# Altium schematic sheet DE-260924.SchDoc: Toroid soft start
size A3; Author: eldar6776@hotmail.com; DrawnBy: Eldar Dedic; Organization: JUBERA d.o.o.; Address1: Braće Mulić 81; Address2: 71000 Sarajevo; Address3: Federacija BiH; Address4: Bosna i Hercegovina; DocumentNumber: DE-100224; Revision: 278; SheetNumber: 1; SheetTotal: 2; SPICEModelCacheBVBUIEPD: <root> / <DocumentId>BVBUIEPD</DocumentId> / <CacheFrame Number="0"> / <Model Name="dpsw3" Kind="CKT"> / <Text>* DIP switch 3 / * jjt 20/6/2002: created / * / *             Switch connections: / *             sw1 / *             |  |  sw2 / *             |  |  |  |  sw3 / *             |  |  |  |  |  | / *             |  |  |  |  |  | / .subckt dpsw3 1  2  4  5  7  8 / + PARAMS: STATE1=0 STATE2=0 STATE3=0 RON=1m ROFF=100E6 / * / V1 3 0 {STATE1} / V2 6 0 {STATE2} / V3 9 0 {STATE3} / * / SDIP1 1 2 3 0 DIPMOD / SDIP2 4 5 6 0 DIPMOD / SDIP3 7 8 9 0 DIPMOD / * / .MODEL DIPMOD SW(VT=0.5 RON={RON} ROFF={ROFF}) / .ends dpsw3</Text> / </Model> / <Model Name="bzt52c3v3" Kind="CKT"> / <Text>*BZT52C3V3 MCE 4/8/98 / *Ref: Diodes Incorporated, 1994 / *3.3V 410mW Si Zener pkg:60A2 1,2 / .SUBCKT BZT52C3V3 1 2 / *    TERMINALS:  A K / D1 1 2  DF / DZ 3 1  DR / VZ 2 3  2.591 / .MODEL DF D (IS=2.06N RS=0.102 N=1.7 CJO=149P VJ=0.75 M=0.33 TT=50.1N) / .MODEL DR D (IS=1.11M RS=28.5 N=13) / .ENDS</Text> / </Model> / <Model Name="bzt52c12" Kind="CKT"> / <Text>*BZT52C12 MCE 4/8/98 / *Ref: Diodes Incorporated, 1994 / *12V 410mW Si Zener pkg:60A2 1,2 / .SUBCKT BZT52C12 1 2 / *    TERMINALS:  A K / D1 1 2  DF / DZ 3 1  DR / VZ 2 3  11.46 / .MODEL DF D (IS=2.06N RS=0.102 N=1.7 CJO=47.5P VJ=1 M=0.33 TT=50.1N) / .MODEL DR D (IS=16.5U RS=7.5 N=3.4) / .ENDS</Text> / </Model> / </CacheFrame> / </root>
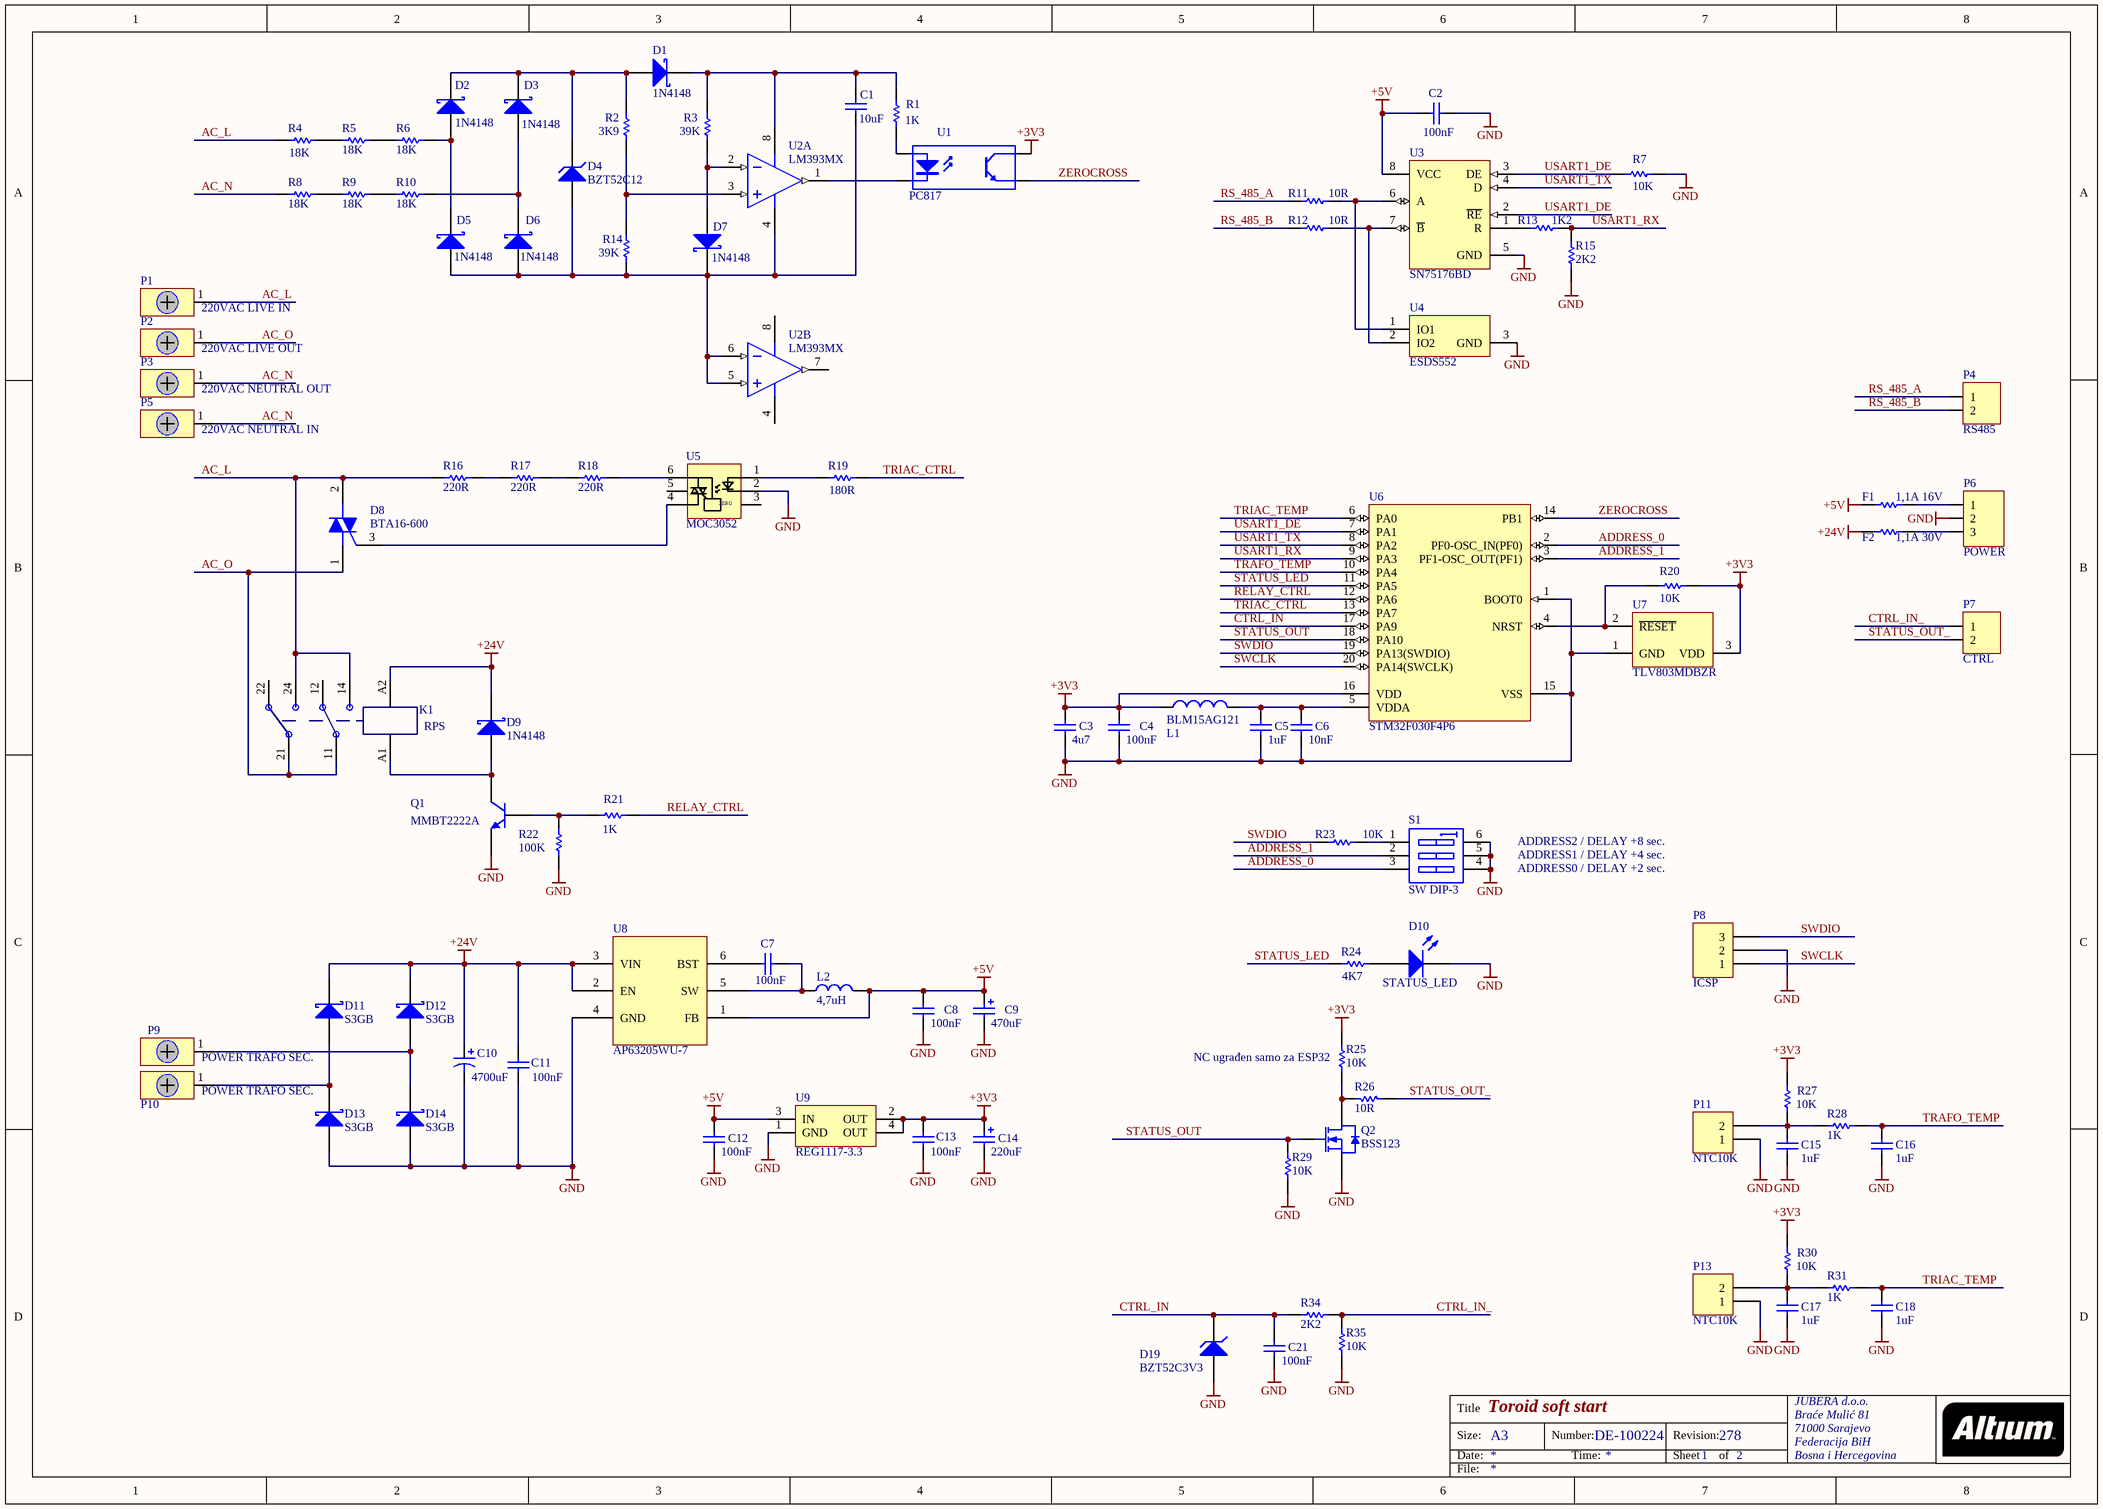
[diagram p0: DE-260924.SchDoc]

## Parts
C1  value 10uF  [0805]
C2  value 100nF  [0603]
C3  value 4u7  [0805]  (hidden comment: C0805)
C4  value 100nF  [0603]  (hidden comment: C0603)
C5  value 1uF  [0603]  (hidden comment: C0603)
C6  value 10nF  [0603]  (hidden comment: C0603)
C7  value 100nF  [0603]
C8  value 100nF  [0603]  (hidden comment: C0603)
C9  470uF  [SMD,D6.3xL7.7mm Aluminum Electrolytic Capacitors]
C10  4700uF  [CAPPR5-13X25]
C11  value 100nF  [0603]
C12  value 100nF  [0603]
C13  value 100nF  [0603]
C14  220uF  [SMD,D6.3xL7.7mm Aluminum Electrolytic Capacitors]
C15  1uF  [0603]
C16  value 1uF  [0603]
C17  value 1uF  [0603]
C18  value 1uF  [0603]
C21  value 100nF  [0603]
D1  1N4148  [SOD323]
D2  1N4148  [SOD323]
D3  1N4148  [SOD323]
D4  BZT52C12  [SOD-123]
D5  1N4148  [SOD323]
D6  1N4148  [SOD323]
D7  1N4148  [SOD323]
D8  BTA16-600  [ONSC-TO-220-3-221A-07]
D9  1N4148  [SOD323]
D10  STATUS_LED  [1.6X0.8X0.8]
D11  S3GB  [SMB]
D12  S3GB  [SMB]
D13  S3GB  [SMB]
D14  S3GB  [SMB]
D19  BZT52C3V3  [SOD-123]
F1  1,1A 16V  [12-1812]
F2  1,1A 30V  [12-1812]
K1  RPS  [RPS 2CO 8A 24V]
L1  BLM15AG121  [0603]
L2  4,7uH  [XRNR4030-4.7uH/M]
P1  220VAC LIVE IN  [WIRE PAD]
P2  220VAC LIVE OUT  [WIRE PAD]
P3  220VAC NEUTRAL OUT  [WIRE PAD]
P4  RS485  [TERMINAL BLOK 2]
P5  220VAC NEUTRAL IN  [WIRE PAD]
P6  POWER  [TERMINAL BLOK 3]
P7  CTRL  [TERMINAL BLOK 2]
P8  ICSP  [HDR1X3]
P9  POWER TRAFO SEC.  [WIRE PAD]
P10  POWER TRAFO SEC.  [WIRE PAD]
P11  NTC10K  [HDR1X2]
P13  NTC10K  [HDR1X2]
Q1  MMBT2222A  [SOT23_N]
Q2  BSS123  [SOT23_N]
R1  1K  [ERA-0603]
R2  3K9  [ERA-0603]
R3  39K  [ERA-0603]
R4  value 18K  [ERA-0805]  (hidden comment: 0805)
R5  18K  [ERA-0805]
R6  18K  [ERA-0805]
R7  10K  [ERA-0603]
R8  18K  [ERA-0805]
R9  18K  [ERA-0805]
R10  18K  [ERA-0805]
R11  10R  [ERA-0805]
R12  10R  [ERA-0805]
R13  1K2  [ERA-0603]
R14  39K  [ERA-0603]
R15  2K2  [ERA-0603]
R16  220R  [ERA-0805]
R17  220R  [ERA-0805]
R18  220R  [ERA-0805]
R19  180R  [ERA-0603]
R20  value 10K  [ERA-0603]  (hidden comment: 180R)
R21  1K  [ERA-0603]
R22  100K  [ERA-0603]
R23  value 10K  [ERA-0603]  (hidden comment: 180R)
R24  value 4K7  [ERA-0603]  (hidden comment: 180R)
R25  value 10K  [ERA-0603]  (hidden comment: 180R)
R26  10R  [ERA-0603]
R27  10K  [ERA-0603]
R28  1K  [ERA-0603]
R29  value 10K  [ERA-0603]  (hidden comment: 180R)
R30  10K  [ERA-0603]
R31  1K  [ERA-0603]
R34  value 2K2  [ERA-0603]  (hidden comment: 180R)
R35  value 10K  [ERA-0603]  (hidden comment: 180R)
S1  SW DIP-3  [DIP-6]
U1  PC817  [DIP-4]
U2  LM393MX  [M08A_N]  (parts A,B of 2)
U3  SN75176BD  [D008_N]
U4  ESDS552  [DCK3_N]
U5  MOC3052  [DIP6]
U6  STM32F030F4P6  [STM-TSSOP20_N]
U7  TLV803MDBZR  [DBZ3_N]
U8  AP63205WU-7  [TSOT-26]
U9  REG1117-3.3  [ZZ311]

## Nets
+3V3: C3.2 C4.2 C13.2 C14.1 L1.1 R20.1 R25.1 R27.2 R30.2 U1.4(C) U6.16(VDD) U7.3(VDD) U9.2(OUT) U9.4(OUT)
+5V: C2.2 C8.2 C9.1 C12.2 F1.1 L2.1 U3.8(VCC) U8.1(FB) U9.3(IN)
+24V: C10.1 C11.2 D9.1(K) D11.2(K) D12.2(K) F2.1 K1.A2 U8.2(EN) U8.3(VIN)
GND: C2.1 C3.1 C4.1 C5.1 C6.1 C8.1 C9.2 C10.2 C11.1 C12.1 C13.1 C14.2 C15.2 C16.2 C17.2 C18.2 C21.1 D10.2(K) D13.1(A) D14.1(A) D19.1(A) P6.2 P8.2 P11.1 P13.1 Q1.2(E) Q2.2(S) R7.2 R15.1 R22.1 R29.2 R35.2 S1.4(B3) S1.5(B2) S1.6(B1) U3.5(GND) U4.3(GND) U5.2 U6.1(BOOT0) U6.15(VSS) U7.1(GND) U8.4(GND) U9.1(GND)
AC_L: D8.2(MT2) K1.14 K1.24 P1.1 R4.1 R16.1
AC_N: P3.1 P5.1 R8.1
AC_O: D8.1(MT1) K1.11 K1.21 P2.1
ADDRESS_0: S1.3(A3) U6.2(PF0-OSC_IN(PF0))
ADDRESS_1: S1.2(A2) U6.3(PF1-OSC_OUT(PF1))
CTRL_IN: C21.2 D19.2(K) R34.1 U6.17(PA9)
CTRL_IN_: P7.1 R34.2 R35.1
RELAY_CTRL: R21.1 U6.12(PA6)
RS_485_A: P4.1 R11.1
RS_485_B: P4.2 R12.1
STATUS_LED: R24.2 U6.11(PA5)
STATUS_OUT: Q2.1(G) R29.1 U6.18(PA10)
STATUS_OUT_: P7.2 R26.2
SWCLK: P8.1 U6.20(PA14(SWCLK))
SWDIO: P8.3 R23.2 U6.19(PA13(SWDIO))
TRAFO_TEMP: C16.1 R28.1 U6.10(PA4)
TRIAC_CTRL: R19.1 U6.13(PA7)
TRIAC_TEMP: C18.1 R31.1 U6.6(PA0)
USART1_DE: R7.1 U3.2(~{RE}) U3.3(DE) U6.7(PA1)
USART1_RX: R13.2 R15.2 U6.9(PA3)
USART1_TX: U3.4(D) U6.8(PA2)
ZEROCROSS: U1.3(E) U6.14(PB1)
NetC1_1: C1.1 D4.1(A) D5.2(A) D6.2(A) D7.1(K) R14.1 U2.4(GND) U2.5(INB+) U2.6(INB-)
NetC1_2: C1.2 D1.1(K) R1.2 R3.2 U2.8(V+)
NetC5_2: C5.2 C6.2 L1.2 U6.5(VDDA)
NetC7_1: C7.1 L2.2 U8.5(SW)
NetC7_2: C7.2 U8.6(BST)
NetC15_1: C15.1 P11.2 R27.1 R28.2
NetC17_1: C17.1 P13.2 R30.1 R31.2
NetD1_2: D1.2(A) D2.1(K) D3.1(K) D4.2(K) R2.2
NetD2_2: D2.2(A) D5.1(K) R6.2
NetD3_2: D3.2(A) D6.1(K) R10.2
NetD7_2: D7.2(A) R3.1 U2.2(INA-)
NetD8_3: D8.3(G) U5.4
NetD9_2: D9.2(A) K1.A1 Q1.3(C)
NetD10_1: D10.1(A) R24.1
NetD11_1: D11.1(A) D13.2(K) P10.1
NetD12_1: D12.1(A) D14.2(K) P9.1
NetF1_2: F1.2 P6.1
NetF2_2: F2.2 P6.3
NetQ1_1: Q1.1(B) R21.2 R22.2
NetQ2_3: Q2.3(D) R25.2 R26.1
NetR1_1: R1.1 U1.1(A)
NetR2_1: R2.1 R14.2 U2.3(INA+)
NetR4_2: R4.2 R5.1
NetR5_2: R5.2 R6.1
NetR8_2: R8.2 R9.1
NetR9_2: R9.2 R10.1
NetR11_2: R11.2 U3.6(A) U4.1(IO1)
NetR12_2: R12.2 U3.7(~{B}) U4.2(IO2)
NetR13_1: R13.1 U3.1(R)
NetR16_2: R16.2 R17.1
NetR17_2: R17.2 R18.1
NetR18_2: R18.2 U5.6
NetR19_2: R19.2 U5.1
NetR20_2: R20.2 U6.4(NRST) U7.2(~{RESET})
NetR23_1: R23.1 S1.1(A1)
NetU1_2: U1.2(K) U2.1(OUTA)

Not connected (* = marked no-connect by the designer): K1 12(5) 22(5); U2 7(OUTB); U5 3 5

## Notes on the sheet
- ADDRESS1 / DELAY +4 sec.
- ADDRESS2 / DELAY +8 sec.
- ADDRESS0 / DELAY +2 sec.
- (near R25) NC ugrađen samo za ESP32
- Title
- Size:
- Date:
- A3
- Number:
- Time:
- Revision:
- Sheet
- of
- File:
- (in symbol MOC3081) ZERO

## Library data of the parts
C1 C3 = C0805: Ceramic Chip Capacitor - Standard; Note: Footprint corresponds to dimensions for bulk cassette packaging. This case size has tightened tolerances.; Published: 17-Jul-2002; LatestRevisionDate: 19-Mar-2004; LatestRevisionNote: Silkscreen size reduced.; DatasheetDocument: Mar-2001; PackageDocument: Mar-2001; PackageReference: 0805; Publisher: Altium Limited; Code_JEITA: 0805; Code_IPC: 2012[0805]; ComponentLink1Description: Manufacturer Link; ComponentLink1URL: http://www.kemet.com/; ComponentLink2Description: Datasheet; ComponentLink2URL: http://www.kemet.com/kemet/web/homepage/kechome.nsf/vapubfilesname/F3102TA.pdf/$file/F3102TA.pdf
C2 C4-C6 C11 C13 C15-C18 C21 = C0603: Ceramic Chip Capacitor - Standard; Note: Footprint corresponds to dimensions for bulk cassette packaging. This case size has tightened tolerances.; Published: 17-Jul-2002; LatestRevisionDate: 19-Mar-2004; LatestRevisionNote: Silkscreen size reduced.; DatasheetDocument: Mar-2001; PackageDocument: Mar-2001; PackageReference: 0603; Publisher: Altium Limited; Code_JEITA: 0603; Code_IPC: 1608 [0603]; ComponentLink1Description: Manufacturer Link; ComponentLink1URL: http://www.kemet.com/; ComponentLink2Description: Datasheet; ComponentLink2URL: http://www.kemet.com/kemet/web/homepage/kechome.nsf/vapubfilesname/F3102TA.pdf/$file/F3102TA.pdf
  C15: Value: 1uF
C7 C8 C12 = C0603: Ceramic Chip Capacitor - 25V; Note: Footprint corresponds to dimensions for bulk cassette packaging. This case size has tightened tolerances.; Published: 17-Jul-2002; LatestRevisionDate: 19-Mar-2004; LatestRevisionNote: Silkscreen size reduced.; DatasheetDocument: Mar-2001; PackageDocument: Mar-2001; PackageReference: 0603; Publisher: Altium Limited; Code_JEITA: 0603; Code_IPC: 1608 [0603]; ComponentLink1Description: Manufacturer Link; ComponentLink1URL: http://www.kemet.com/; ComponentLink2Description: Datasheet; ComponentLink2URL: http://www.kemet.com/kemet/web/homepage/kechome.nsf/vapubfilesname/F3102TA.pdf/$file/F3102TA.pdf
C9 = ROQANG RVT1C471M0607: 470uF 16V 185mA@120Hz ±20% SMD,D6.3xL7.7mm Aluminum Electrolytic Capacitors - SMD ROHS; Note: Refer to Manufacturer's Data Sheets for other lead formations; DrillSize: Nominal, Rounded To The Nearest 0.1mm; Value: 10uF; Published: 19-Mar-2004; DatasheetDocument: 20-Feb-2001; PackageReference: CAPPR2-5X11; Publisher: Altium Limited; ComponentLink1Description: Manufacturer Link; ComponentLink1URL: http://www.vishay.com/; ComponentLink2Description: Datasheet; ComponentLink2URL: http://www.vishay.com/docs/25014/eka.pdf
C10 = EKA00GG447C00: Aluminum Electrolytic Capacitor, Radial Style with Long Leads: 4700uF, 10V; Note: Refer to Manufacturer's Data Sheets for other lead formations; DrillSize: Nominal, Rounded To The Nearest 0.1mm; Published: 19-Mar-2004; DatasheetDocument: 20-Feb-2001; PackageReference: CAPPR5-13X25; Publisher: Altium Limited; ComponentLink1Description: Manufacturer Link; ComponentLink1URL: http://www.vishay.com/; ComponentLink2Description: Datasheet; ComponentLink2URL: http://www.vishay.com/docs/25014/eka.pdf; Value: 4700uF
C14 = ROQANG VT1C221M0607: 220uF 16V 110mA@120Hz ±20% SMD,D6.3xL7.7mm Aluminum Electrolytic Capacitors - SMD ROHS; Note: Refer to Manufacturer's Data Sheets for other lead formations; DrillSize: Nominal, Rounded To The Nearest 0.1mm; Value: 10uF; Published: 19-Mar-2004; DatasheetDocument: 20-Feb-2001; PackageReference: CAPPR2-5X11; Publisher: Altium Limited; ComponentLink1Description: Manufacturer Link; ComponentLink1URL: http://www.vishay.com/; ComponentLink2Description: Datasheet; ComponentLink2URL: http://www.vishay.com/docs/25014/eka.pdf
D1-D3 D5-D7 D9 = 1PS76SB10: Schottky Barrier Diode; Published: 17-Sep-2003; LatestRevisionDate: 19-Mar-2004; LatestRevisionNote: Silkscreen size reduced.; DatasheetVersion: 14-Oct-1996; PackageVersion: May-1999; PackageReference: SOD323; Publisher: Altium Limited; PackageDescription: SOD-323/SC-76; 2 Leads; Body 1.7 x 1.3 mm, (LxW); ComponentLink1Description: Manufacturer Link; ComponentLink1URL: http://www.semiconductors.philips.com/; ComponentLink2Description: Datasheet; ComponentLink2URL: http://www.semiconductors.philips.com/acrobat/datasheets/1PS76SB10_2.pdf
D4 = BZT52C12: Surface Mount Zener Diode; Published: 8-Jun-2000; LatestRevisionDate: 17-Jul-2002; LatestRevisionNote: Re-released for DXP Platform.; DatasheetDocument: REV. L-2; PackageReference: SOD-123; Publisher: Altium Limited; ComponentLink1Description: Manufacturer Link; ComponentLink1URL: http://www.vishay.com/
D8 = BTA08-600BW3G: Triacs, Silicon Bidirectional Thyristor, 3-Pin TO-220, Pb-Free, Tube; Manufacturer: On Semiconductor; IGT Max (mA): 50; IT(RMS) Max (A): 8; ITSM Max (A): 90; DatasheetVersion: Rev. 1; PackageVersion: Rev. O, 07/2008; PackageReference: TO-220-3-221A-07; PackageDescription: 3-Pin Flange Mount, Vertical Straight Lead, Body 9.97 x 4.445 mm, Pitch 2.54 mm; Supplier 1: Digi-Key; Supplier Part Number 1: BTA08-600BW3G-ND; Supplier 2: Newark; Supplier Part Number 2: 13P2072; Supplier 3: Mouser; Supplier Part Number 3: 863-BTA08-600BW3G; Packing: Tube; RoHS: Pb-Free; Mounting Technology: Through Hole; PartNumber: BTA08-600BW3G; ComponentLink1Description: Manufacturer URL; ComponentLink1URL: http://www.onsemi.com/; ComponentLink2Description: Datasheet; ComponentLink2URL: http://www.onsemi.com/pub_link/Collateral/BTA08-600BW3-D.PDF; ComponentLink3Description: Package Specification; ComponentLink3URL: http://www.onsemi.com/pub_link/Collateral/221A-07.PDF
D10 = HSMB-C190: Blue Surface Mount Chip LED, Blue; LuminousIntensity: 1.6mcd (Minimum).; PCB_Layout: Complies with manufacturer's recommendation.; Published: 11-Dec-2002; DatasheetVersion: 26-Feb-2002; PackageVersion: Mar-2002; PackageReference: 1.6X0.8X0.8; Publisher: Altium Limited; PackageDescription: SM LED; 2 Flat Leads; LED_Colour: Blue; ComponentLink1Description: Manufacturer Link; ComponentLink1URL: http://www.avagotech.com/; ComponentLink2Description: Datasheet; ComponentLink2URL: http://cp.literature.agilent.com/litweb/pdf/5988-5211EN.pdf
D11-D14 = D Schottky: Schottky Diode; Published: 8-Jun-2000; LatestRevisionDate: 17-Jul-2002; LatestRevisionNote: Re-released for DXP Platform.; PackageReference: SMB; Publisher: Altium Limited; PackageDescription: DO-214-AA/SMB; 2 C-Bend Leads; Body 5.3 x 3.6 mm, inc. leads (LxW); Code_JEDEC: DO-214-AA
D19 = BZT52C3V3: Surface Mount Zener Diode; Published: 8-Jun-2000; LatestRevisionDate: 17-Jul-2002; LatestRevisionNote: Re-released for DXP Platform.; DatasheetDocument: REV. L-2; PackageReference: SOD-123; Publisher: Altium Limited; ComponentLink1Description: Manufacturer Link; ComponentLink1URL: http://www.vishay.com/
F1 F2 = ERJL12: Retriggerable SMD fuse 1,1A, 16V; Published: 17-Dec-2003; LatestRevisionDate: 19-Mar-2004; LatestRevisionNote: Silkscreen size reduced.; PackageDocument: Mar-2003; PackageReference: 12-1812; Publisher: Altium Limited; ComponentLink1Description: Manufacturer Link; ComponentLink1URL: http://www.panasonic.com/industrial/components/resistive_products.htm; ComponentLink2Description: Datasheet; ComponentLink2URL: http://www.panasonic.com/industrial/components/pdf/AOA0000CE3.pdf
K1 = PCB relay 2CO, 8A, 24VDC, RPS serie 5mm
L1 = Chip inductor: SMD chip inductor; Code_IEC: 1005; Published: 8-Jun-2000; LatestRevisionDate: 29-May-2009; LatestRevisionNote: IPC-7351 Footprint Added.; PackageReference: 0402-A; Publisher: Altium Limited; PackageDescription: Chip Inductor; Code_JEITA: 0402
L2 = Inductor
P1-P3 P5 P9 P10 = Wire Lug
P4 P7 = TERMINAL BLOK 2: Terminal blok konektor 3,5 mm
P6 = TERMINAL BLOK 3: 3 pinski terminal blok konektor
P8 = Header 3: Header, 3-Pin; LatestRevisionDate: 17-Jul-2002; LatestRevisionNote: Re-released for DXP Platform.; Publisher: Altium Limited
P11 P13 = Header 2: Header, 2-Pin; LatestRevisionDate: 17-Jul-2002; LatestRevisionNote: Re-released for DXP Platform.; Publisher: Altium Limited
Q1 = BC817: NPN General-purpose Transistor; Published: 17-Sep-2003; LatestRevisionDate: 12-Dec-2006; LatestRevisionNote: IPC-7351 Footprint Added.; DatasheetVersion: Jun-1999; PackageVersion: May-1999; PackageReference: SOT23; Publisher: Altium Limited; PackageDescription: 3-Pin SOT-23 Package 0.95 mm Pitch, 2.3 mm Lead Span; ComponentLink1Description: Manufacturer Link; ComponentLink1URL: http://www.semiconductors.philips.com/; ComponentLink2Description: Datasheet; ComponentLink2URL: http://www.semiconductors.philips.com/acrobat/datasheets/BC817_BC817W_BC337_5.pdf
Q2 = BSS123: N-channel Enhancement Mode Vertical D-MOSFET; Published: 17-Sep-2003; LatestRevisionDate: 12-Dec-2006; LatestRevisionNote: IPC-7351 Footprint Added.; DatasheetVersion: Apr-1995; PackageVersion: May-1999; PackageReference: SOT23; Publisher: Altium Limited; PackageDescription: 3-Pin SOT-23 Package 0.95 mm Pitch, 2.3 mm Lead Span; ComponentLink1Description: Manufacturer Link; ComponentLink1URL: http://www.semiconductors.philips.com/; ComponentLink2Description: Datasheet; ComponentLink2URL: http://www.semiconductors.philips.com/acrobat/datasheets/BSS123_3.pdf
R1-R3 R7 R13-R15 R19-R25 R27-R31 R34 R35 = ERAV: Metal Film Thermosensitive Chip Resistor, 0.56 Ohm to 10k Ohm Range, 5% Tolerance, 0603 Size, 0.063 W; Note: If flow soldering, adjust pad width of PCB Footprint to 0.7 - 0.8 times the width of the resistor.; Published: 17-Dec-2003; LatestRevisionDate: 19-Mar-2004; LatestRevisionNote: Silkscreen size reduced.; PackageDocument: Mar-2003; PackageReference: ERA-0603; Publisher: Altium Limited; Code_IPC: 1608 [0603]; ComponentLink1Description: Manufacturer Link; ComponentLink1URL: http://www.panasonic.com/industrial/components/resistive_products.htm; ComponentLink2Description: Datasheet; ComponentLink2URL: http://www.panasonic.com/industrial/components/pdf/AOF0000CE1.pdf
  R19: Value: 180R
R4-R6 R8-R12 R16-R18 = ERAS: Metal Film Thermosensitive Chip Resistor, 0.56 Ohm to 10k Ohm Range, 5% Tolerance, 0805 Size, 0.1 W; Note: If flow soldering, adjust pad width of PCB Footprint to 0.7 - 0.8 times the width of the resistor.; Published: 17-Dec-2003; LatestRevisionDate: 19-Mar-2004; LatestRevisionNote: Silkscreen size reduced.; PackageDocument: Mar-2003; PackageReference: ERA-0805; Publisher: Altium Limited; Code_IPC: 2012 [0805]; ComponentLink1Description: Manufacturer Link; ComponentLink1URL: http://www.panasonic.com/industrial/components/resistive_products.htm; ComponentLink2Description: Datasheet; ComponentLink2URL: http://www.panasonic.com/industrial/components/pdf/AOF0000CE1.pdf
R26 = ERA6Y: Rectangular Thick Film Chip Resistor, 10 Ohm to 1M Ohm Range, 0.1% and 0.5% Tolerance, 0805 Size, 0.1 W; Note: If flow soldering, adjust pad width of PCB Footprint to 0.7 - 0.8 times the width of the resistor.; Published: 17-Dec-2003; LatestRevisionDate: 19-Mar-2004; LatestRevisionNote: Silkscreen size reduced.; PackageDocument: Mar-2003; PackageReference: ERA-0805; Publisher: Altium Limited; Code_IPC: 2012 [0805]; ComponentLink1Description: Manufacturer Link; ComponentLink1URL: http://www.panasonic.com/industrial/components/resistive_products.htm; ComponentLink2Description: Datasheet; ComponentLink2URL: http://www.panasonic.com/industrial/components/pdf/AOA0000CE8.pdf
S1 = SW DIP-3: DIP Switch, 3 Position, SPST; Published: 24-Mar-1999; LatestRevisionDate: 17-Jul-2002; LatestRevisionNote: Re-released for DXP Platform.; PackageReference: DIP-6; Publisher: Altium Limited; Code_JEDEC: MO-001-AM
U1 = PC817: 4-Pin Phototransistor Optocoupler; Published: 24-Mar-1999; LatestRevisionDate: 04-Mar-2005; LatestRevisionNote: Sch pins 3 & 4 Swapped.; DatasheetVersion: Nov-2003; PackageReference: DIP-4; Publisher: Altium Limited
U2 = LM393MX: Low Power Low Offset Voltage Dual Comparator, 8-pin Narrow SOIC; Manufacturer: National Semiconductor; PackageTopMarking: NSZXTT*LM*393M; PowerWise: N; High-Reliability: Y; DatasheetVersion: Aug-2002; PackageVersion: revM, May-2009; PackageReference: M08A; PackageDescription: SOIC Narrow, 4.9 x 3.9 x 1.45mm, 8 Lead, 1.27mm Pitch; PartNumber: LM393MX; RoHS: N; PinCount: 8; CompType: Comparator; Code_JEDEC: MS-012-AA; Code_IPC: SOIC127P600-8; ComponentLink1Description: Manufacturer URL; ComponentLink1URL: http://www.national.com/; ComponentLink2Description: LM393 Datasheet; ComponentLink2URL: http://www.national.com/ds/LM/LM393.pdf; ComponentLink3Description: LM393 Web Page; ComponentLink3URL: http://www.national.com/pf/LM/LM393.html; ComponentLink4Description: M08A Package Page; ComponentLink4URL: http://www.national.com/packaging/folders/m08a.html
U3 = SN75176BD: Differential Bus Transceiver; Note: Receiver Hysteresis of 50mV Typical; Published: 15-May-2002; LatestRevisionDate: 13-Apr-2006; LatestRevisionNote: IPC-7351 Footprint Added.; DatasheetVersion: Sep-1989; PackageVersion: Jan-1998; PackageReference: D008; Publisher: Altium Limited; PackageDescription: 8-Pin Small Outline Integrated Circuit 1.27 mm Pitch; Code_IPC: SOIC127P600-8; ComponentLink1Description: Manufacturer Link; ComponentLink1URL: http://www.ti.com/; ComponentLink2Description: Datasheet; ComponentLink2URL: http://www-s.ti.com/sc/ds/sn75176b.pdf
U4 = TPD2E007DCKR: ESD Protection Array for AC Signal Data Interface, 2 Channels, -40 to +85 degC, 3-pin SC70 (DCK), Green (RoHS & no Sb/Br); Manufacturer: Texas Instruments; Breakdown Voltage(Min)(V): +/-14; IEC 61000-4-2 Air-Gap(+/- kV): 15; IEC 61000-4-2 Contact(+/- kV): 8; IO Leakage Current(nA): 50; SubFamily: ESD Solution; DatasheetVersion: SLVS796E; PackageVersion: revG, Jan-2007; PackageReference: DCK3; PackageDescription: 3-Pin Plastic Small-Outline Package, 0.65 mm Pitch, 2.1 mm Lead Span; Supplier 1: Digi-Key; Supplier Part Number 1: 296-25281-2-ND; Supplier 2: Digi-Key; Supplier Part Number 2: 296-25281-1-ND; Supplier 3: Digi-Key; Supplier Part Number 3: 296-25281-6-ND; Supplier 4: Farnell; Supplier Part Number 4: 2120465; Supplier 5: Newark; Supplier Part Number 5: 94T5089; Supplier 6: Newark; Supplier Part Number 6: 55R7554; Supplier 7: Mouser; Supplier Part Number 7: 595-TPD2E007DCKR; Eco-Plan: Green (RoHS & no Sb/Br); IO Capacitance(Typ)(pF): 15; Mounting Technology: Surface Mount; PartNumber: TPD2E007DCKR; ComponentLink1Description: Datasheet; ComponentLink1URL: http://www.ti.com/general/docs/lit/getliterature.tsp?genericPartNumber=TPD2E007&fileType=pdf; ComponentLink2Description: URL Link1; ComponentLink2URL: SamplesURL:http://www.ti.com/product/tpd2e007#samples
U5 = MOC3081: Zero-Cross Optoisolator Triac Driver
U6 = STM32F030F4P6: ARM Cortex-M0 32-bit MCU, 16 KB Flash, 4 KB Internal RAM, 15 I/Os, 20-pin TSSOP, -40 to 85 degC, Tube; FLASH Size (Prog) (kB): 16; I/Os (High Current): 15; Internal RAM Size (kB): 4; Operating Frequency(F) (Processor speed) (MHz): 48; Supply Voltage(Vcc) min (V): 2.4; DatasheetVersion: Rev. 1; PackageVersion: Rev. 1, 11/2012; PackageReference: TSSOP20; PackageDescription: 20-Pin Thin Shrink Small Outline Package, 6.5 x 4.4 mm Body, 0.65 mm Pitch; Supplier 1: Digi-Key; Supplier Part Number 1: 497-14044-5-ND; Supplier 2: Newark; Supplier Part Number 2: 06X3648; Supplier 3: Mouser; Supplier Part Number 3: 511-STM32F030F4P6; Core: ARM Cortex-M0; Packing: Tube; Mounting Technology: Surface Mount; PartNumber: STM32F030F4P6; ComponentLink1Description: Manufacturer URL; ComponentLink1URL: http://www.st.com/web/en/home.html; ComponentLink2Description: Datasheet; ComponentLink2URL: http://www.st.com/st-web-ui/static/active/en/resource/technical/document/datasheet/DM00088500.pdf; ComponentLink3Description: Package Specification; ComponentLink3URL: http://www.st.com/st-web-ui/static/active/en/resource/technical/document/datasheet/DM00065136.pdf
U7 = TLV803MDBZR: Voltage Supervisor with Active-Low, Open Drain Reset, 1 Supply Monitored, -40 to 125 degC, 3-pin SOT-23 (DBZ), Green (RoHS & no Sb/Br); Manufacturer: Texas Instruments; # of supplies monitored: 1; Iq(Typ)(uA): 9; Output Driver Type / Reset Output: Active-low, Open-drain; Rating: Catalog; Reset Threshold Accuracy(%): 2; SubFamily: Supervisor and Reset IC; Threshold Voltage 1 (typ)(Typ)(V): 4.38; Time Delay(ms): 200; VCC(Max)(V): 6; VCC(Min)(V): 1.1; DatasheetVersion: SBVS157B; PackageVersion: revB, Apr-2005; PackageReference: DBZ3; PackageDescription: 3-Pin Plastic Small-Outline Package, 0.95 mm Pitch, 2.4 mm Lead Span; Supplier 1: Digi-Key; Supplier Part Number 1: 296-29194-2-ND; Supplier 2: Digi-Key; Supplier Part Number 2: 296-29194-1-ND; Supplier 3: Digi-Key; Supplier Part Number 3: 296-29194-6-ND; Supplier 4: Newark; Supplier Part Number 4: 58T0286; Supplier 5: Mouser; Supplier Part Number 5: 595-TLV803MDBZR; Mounting Technology: Surface Mount; Code_JEDEC: TO-236-AB; PartNumber: TLV803MDBZR; ComponentLink1Description: Datasheet; ComponentLink1URL: http://www.ti.com/general/docs/lit/getliterature.tsp?genericPartNumber=TLV803M&fileType=pdf
U8 = AP63200: 2A synchronous  buck converter
U9 = REG1117-3.3: 800mA and 1A Low Dropout Positive Regulator 2.85V, 3.3V, 5V, and Adjustable; Published: 8-Jun-2000; LatestRevisionDate: 17-Jul-2002; LatestRevisionNote: Re-released for DXP Platform.; DatasheetVersion: Sep-1997; PackageVersion: revC; PackageReference: ZZ311; Publisher: Altium Limited; PackageDescription: SOT-223/SC-73; 4 Leads; Body 6.7 x 7.3 mm, inc. leads (LxW max); ComponentLink1Description: Manufacturer Link; ComponentLink1URL: http://www.ti.com/; ComponentLink2Description: Datasheet; ComponentLink2URL: http://www-s.ti.com/sc/ds/REG1117.pdf